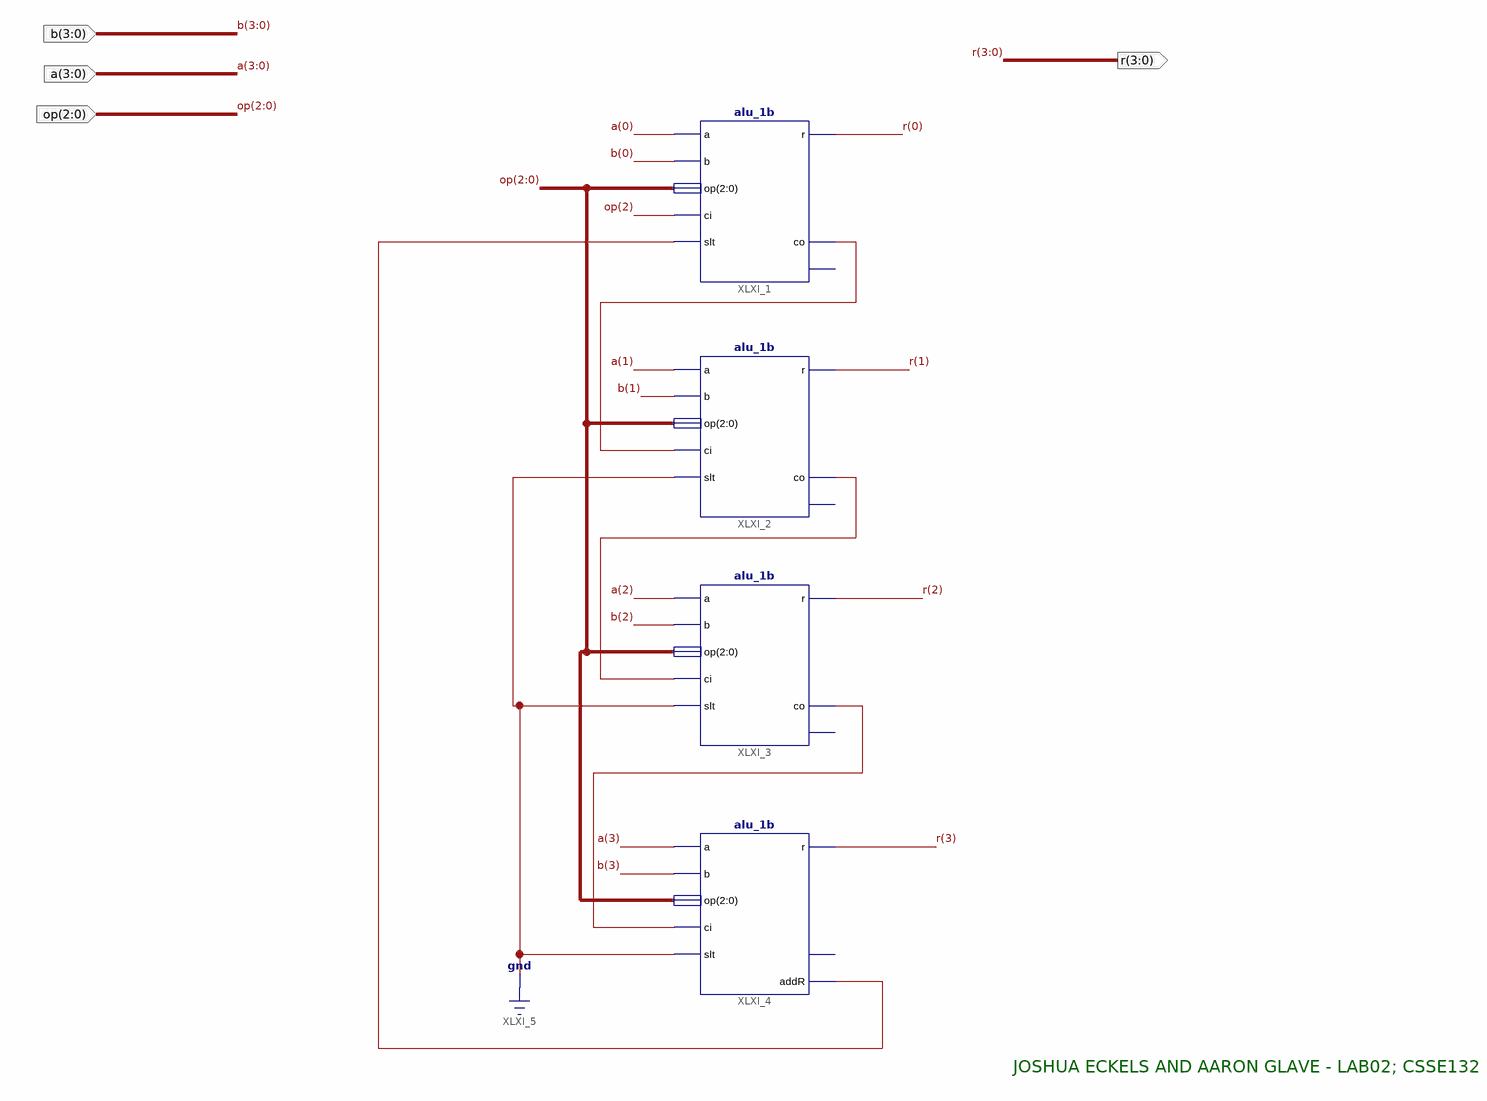
[diagram p0: schematic sheet 1]
// Xilinx ISE schematic alu_4b.sch (spartan3e) as structural Verilog: 4 symbols, 4 ports
module alu_4b (
  input  [2:0] op,
  input  [3:0] a,
  input  [3:0] b,
  output [3:0] r
);

  wire addR, XLXN_26, XLXN_27, XLXN_28;

  alu_1b XLXI_1 (.a(a[0]), .b(b[0]), .op(op), .ci(op[2]), .slt(addR), .r(r[0]), .co(XLXN_26));  // open: addR
  alu_1b XLXI_2 (.a(a[1]), .b(b[1]), .op(op), .ci(XLXN_26), .slt(1'b0), .r(r[1]), .co(XLXN_27));  // open: addR
  alu_1b XLXI_3 (.a(a[2]), .b(b[2]), .op(op), .ci(XLXN_27), .slt(1'b0), .r(r[2]), .co(XLXN_28));  // open: addR
  alu_1b XLXI_4 (.a(a[3]), .b(b[3]), .op(op), .ci(XLXN_28), .slt(1'b0), .r(r[3]), .addR(addR));  // open: co

  // Notes on the sheet:
  //   JOSHUA ECKELS AND AARON GLAVE - LAB02; CSSE132
endmodule
